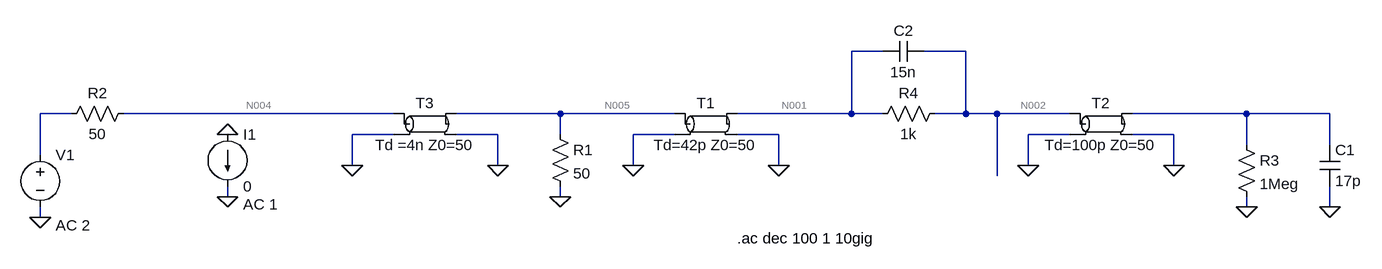
[diagram p0: schematic sma-bnc-feedthrough-term.asc]
sma-bnc-feedthrough-term.asc, the LTspice schematic file:
Version 4
SHEET 1 1160 680
WIRE 416 64 368 64
WIRE 544 64 480 64
WIRE -832 160 -880 160
WIRE -336 160 -752 160
WIRE -80 160 -240 160
WIRE 96 160 -80 160
WIRE 368 160 368 64
WIRE 368 160 192 160
WIRE 416 160 368 160
WIRE 544 160 544 64
WIRE 544 160 496 160
WIRE 592 160 544 160
WIRE 704 160 592 160
WIRE 976 160 800 160
WIRE 1104 160 976 160
WIRE -336 192 -400 192
WIRE -176 192 -240 192
WIRE -80 192 -80 160
WIRE 96 192 32 192
WIRE 256 192 192 192
WIRE 704 192 640 192
WIRE 864 192 800 192
WIRE 976 208 976 160
WIRE 1104 208 1104 160
WIRE -880 224 -880 160
WIRE -400 240 -400 192
WIRE -176 240 -176 192
WIRE 32 240 32 192
WIRE 256 240 256 192
WIRE 640 240 640 192
WIRE 864 240 864 192
WIRE 592 256 592 160
WIRE -592 288 -592 272
WIRE -80 288 -80 272
WIRE 976 304 976 288
WIRE 1104 304 1104 272
WIRE -880 320 -880 304
FLAG -80 288 0
FLAG -880 320 0
FLAG 32 240 0
FLAG 256 240 0
FLAG 640 240 0
FLAG 864 240 0
FLAG 976 304 0
FLAG 1104 304 0
FLAG -592 288 0
FLAG -400 240 0
FLAG -176 240 0
FLAG -592 192 0
SYMBOL tline 144 176 R0
SYMATTR InstName T1
SYMATTR Value Td=42p Z0=50
SYMBOL res -96 176 R0
SYMATTR InstName R1
SYMATTR Value 50
SYMBOL res -736 144 R90
WINDOW 0 0 56 VBottom 2
WINDOW 3 32 56 VTop 2
SYMATTR InstName R2
SYMATTR Value 50
SYMBOL voltage -880 208 R0
WINDOW 123 24 124 Left 2
WINDOW 39 0 0 Left 0
SYMATTR InstName V1
SYMATTR Value ""
SYMATTR Value2 AC 2
SYMBOL tline 752 176 R0
SYMATTR InstName T2
SYMATTR Value Td=100p Z0=50
SYMBOL res 960 192 R0
SYMATTR InstName R3
SYMATTR Value 1Meg
SYMBOL cap 1088 208 R0
SYMATTR InstName C1
SYMATTR Value 17p
SYMBOL cap 480 48 R90
WINDOW 0 0 32 VBottom 2
WINDOW 3 32 32 VTop 2
SYMATTR InstName C2
SYMATTR Value 15n
SYMBOL res 512 144 R90
WINDOW 0 0 56 VBottom 2
WINDOW 3 32 56 VTop 2
SYMATTR InstName R4
SYMATTR Value 1k
SYMBOL current -592 192 R0
WINDOW 123 24 108 Left 2
WINDOW 39 0 0 Left 0
SYMATTR InstName I1
SYMATTR Value 0
SYMATTR Value2 AC 1
SYMBOL tline -288 176 R0
SYMATTR InstName T3
SYMATTR Value Td =4n Z0=50
TEXT 192 352 Left 2 !.ac dec 100 1 10gig

The netlist it stands for:
* sma-bnc-feedthrough-term.asc
T1 N005 0 N001 0 Td=42p Z0=50
R1 N005 0 50
R2 N004 N003 50
V1 N003 0 AC 2
T2 N002 0 N006 0 Td=100p Z0=50
R3 N006 0 1Meg
C1 N006 0 17p
C2 N002 N001 15n
R4 N002 N001 1k
I1 0 0 0 AC 1
T3 N004 0 N005 0 Td =4n Z0=50
.ac dec 100 1 10gig
.backanno
.end

* Results of the author's LTspice run, read from the files saved beside the schematic
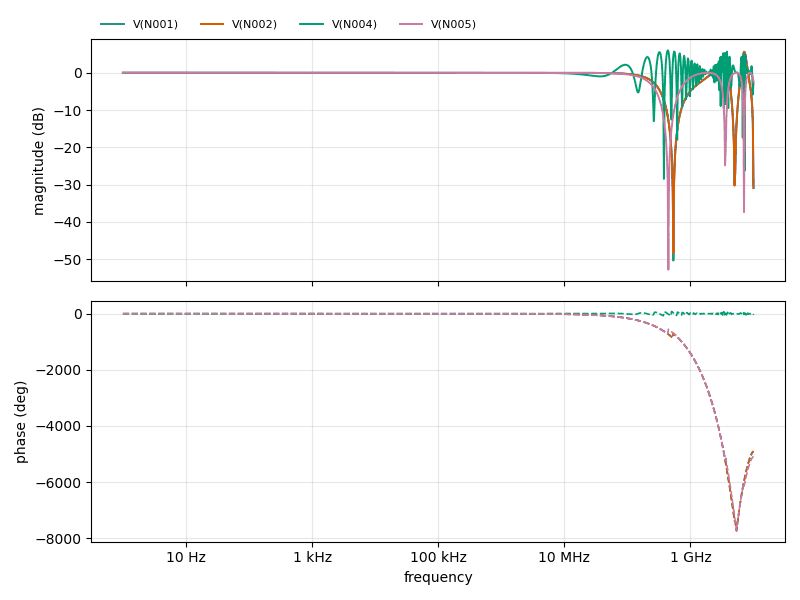
[diagram p1: AC Analysis of sma-bnc-feedthrough-term.asc, plotted from the saved traces]
* AC Analysis, 1 run:
*   V(N001): -0.00 dB at 1 Hz, -30.94 dB at 10 GHz, peak 5.65 dB at 7.079 GHz, 3 dB below the peak at 6.603 GHz and 7.805 GHz
*   V(N002): -0.01 dB at 1 Hz, -30.95 dB at 10 GHz, peak 5.65 dB at 7.079 GHz, 3 dB below the peak at 6.603 GHz and 7.805 GHz
*   V(N004): -0.00 dB at 1 Hz, -2.45 dB at 10 GHz, peak 6.01 dB at 436.5 MHz, 3 dB below the peak at 409.3 MHz and 467.2 MHz
*   V(N005): -0.00 dB at 1 Hz, -2.45 dB at 10 GHz, peak -0.00 dB at 1.862 GHz, 3 dB below the peak at 783.2 MHz and 3.068 GHz